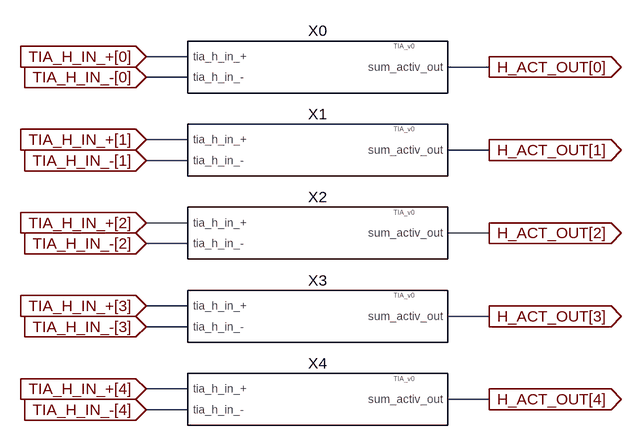
[diagram p0: schematic X_aux_10by5.asc]
X_aux_10by5.asc, the LTspice schematic file:
Version 4 
SHEET 1 880 680
WIRE 48 80 -16 80
WIRE 48 112 -16 112
WIRE 512 96 448 96
WIRE 48 208 -16 208
WIRE 48 240 -16 240
WIRE 512 224 448 224
WIRE 48 336 -16 336
WIRE 48 368 -16 368
WIRE 512 352 448 352
WIRE 48 464 -16 464
WIRE 48 496 -16 496
WIRE 512 480 448 480
WIRE 48 592 -16 592
WIRE 48 624 -16 624
WIRE 512 608 448 608
FLAG -16 80 TIA_H_IN_+[0]
IOPIN -16 80 IN
FLAG -16 112 TIA_H_IN_-[0]
IOPIN -16 112 IN
FLAG 512 96 H_ACT_OUT[0]
IOPIN 512 96 OUT
FLAG -16 208 TIA_H_IN_+[1]
IOPIN -16 208 IN
FLAG -16 240 TIA_H_IN_-[1]
IOPIN -16 240 IN
FLAG 512 224 H_ACT_OUT[1]
IOPIN 512 224 OUT
FLAG -16 336 TIA_H_IN_+[2]
IOPIN -16 336 IN
FLAG -16 368 TIA_H_IN_-[2]
IOPIN -16 368 IN
FLAG 512 352 H_ACT_OUT[2]
IOPIN 512 352 OUT
FLAG -16 464 TIA_H_IN_+[3]
IOPIN -16 464 IN
FLAG -16 496 TIA_H_IN_-[3]
IOPIN -16 496 IN
FLAG 512 480 H_ACT_OUT[3]
IOPIN 512 480 OUT
FLAG -16 592 TIA_H_IN_+[4]
IOPIN -16 592 IN
FLAG -16 624 TIA_H_IN_-[4]
IOPIN -16 624 IN
FLAG 512 608 H_ACT_OUT[4]
IOPIN 512 608 OUT
SYMBOL column_activ_tia_relu 240 96 R0
SYMATTR InstName X0
SYMBOL column_activ_tia_relu 240 224 R0
SYMATTR InstName X1
SYMBOL column_activ_tia_relu 240 352 R0
SYMATTR InstName X2
SYMBOL column_activ_tia_relu 240 480 R0
SYMATTR InstName X3
SYMBOL column_activ_tia_relu 240 608 R0
SYMATTR InstName X4

The netlist it stands for:
* X_aux_10by5.asc
XX0 TIA_H_IN_+[0] TIA_H_IN_-[0] H_ACT_OUT[0] column_activ_tia_relu  ; pins tia_h_in_+ tia_h_in_- sum_activ_out
XX1 TIA_H_IN_+[1] TIA_H_IN_-[1] H_ACT_OUT[1] column_activ_tia_relu  ; pins tia_h_in_+ tia_h_in_- sum_activ_out
XX2 TIA_H_IN_+[2] TIA_H_IN_-[2] H_ACT_OUT[2] column_activ_tia_relu  ; pins tia_h_in_+ tia_h_in_- sum_activ_out
XX3 TIA_H_IN_+[3] TIA_H_IN_-[3] H_ACT_OUT[3] column_activ_tia_relu  ; pins tia_h_in_+ tia_h_in_- sum_activ_out
XX4 TIA_H_IN_+[4] TIA_H_IN_-[4] H_ACT_OUT[4] column_activ_tia_relu  ; pins tia_h_in_+ tia_h_in_- sum_activ_out
.backanno
.end